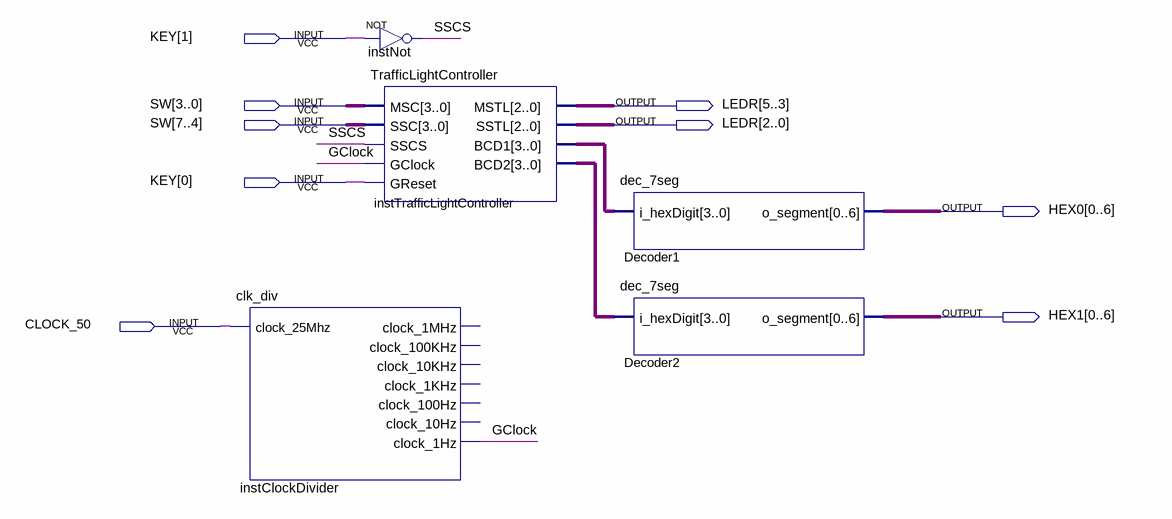
[diagram p0: schematic sheet]
// Quartus schematic Project.bdf as structural Verilog: 5 symbols, 9 pins
module Project (
  input  [1:0] KEY,
  input  [7:0] SW,
  input  CLOCK_50,
  output [5:0] LEDR,
  output [0:6] HEX0,
  output [0:6] HEX1
);

  wire GClock, SSCS;
  wire [3:0] instTrafficLightController_bcd1, instTrafficLightController_bcd2;

  clk_div instClockDivider (
    .clock_25Mhz(CLOCK_50), .clock_1Hz(GClock));  // open: clock_1MHz, clock_100KHz, clock_10KHz, clock_1KHz, clock_100Hz, clock_10Hz
  not instNot (SSCS, KEY[1]);
  TrafficLightController instTrafficLightController (
    .MSC(SW[3:0]), .SSC(SW[7:4]), .SSCS(SSCS), .GClock(GClock), .GReset(KEY[0]), .MSTL(LEDR[5:3]),
    .SSTL(LEDR[2:0]), .BCD1(instTrafficLightController_bcd1), .BCD2(instTrafficLightController_bcd2));
  dec_7seg Decoder1 (.i_hexDigit(instTrafficLightController_bcd1), .o_segment(HEX0));
  dec_7seg Decoder2 (.i_hexDigit(instTrafficLightController_bcd2), .o_segment(HEX1));
endmodule
